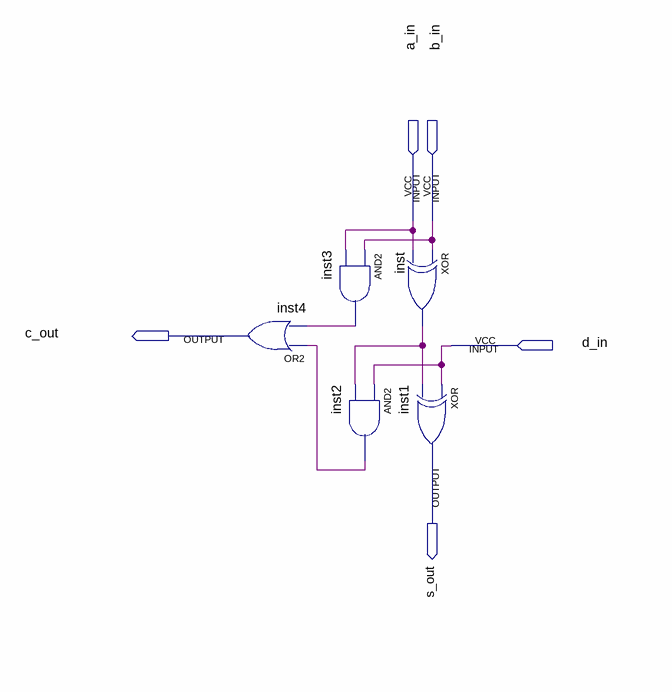
[diagram p0: schematic sheet]
// Quartus schematic FA.bdf as structural Verilog: 5 symbols, 5 pins
module FA (
  input  a_in,
  input  b_in,
  input  d_in,
  output c_out,
  output s_out
);

  wire inst2_out, inst3_out, inst_out;

  or inst4 (c_out, inst2_out, inst3_out);
  and inst3 (inst3_out, b_in, a_in);
  and inst2 (inst2_out, d_in, inst_out);
  xor inst (inst_out, b_in, a_in);
  xor inst1 (s_out, d_in, inst_out);
endmodule
